# EAGLE design kompass2 (EAGLE 4.16)
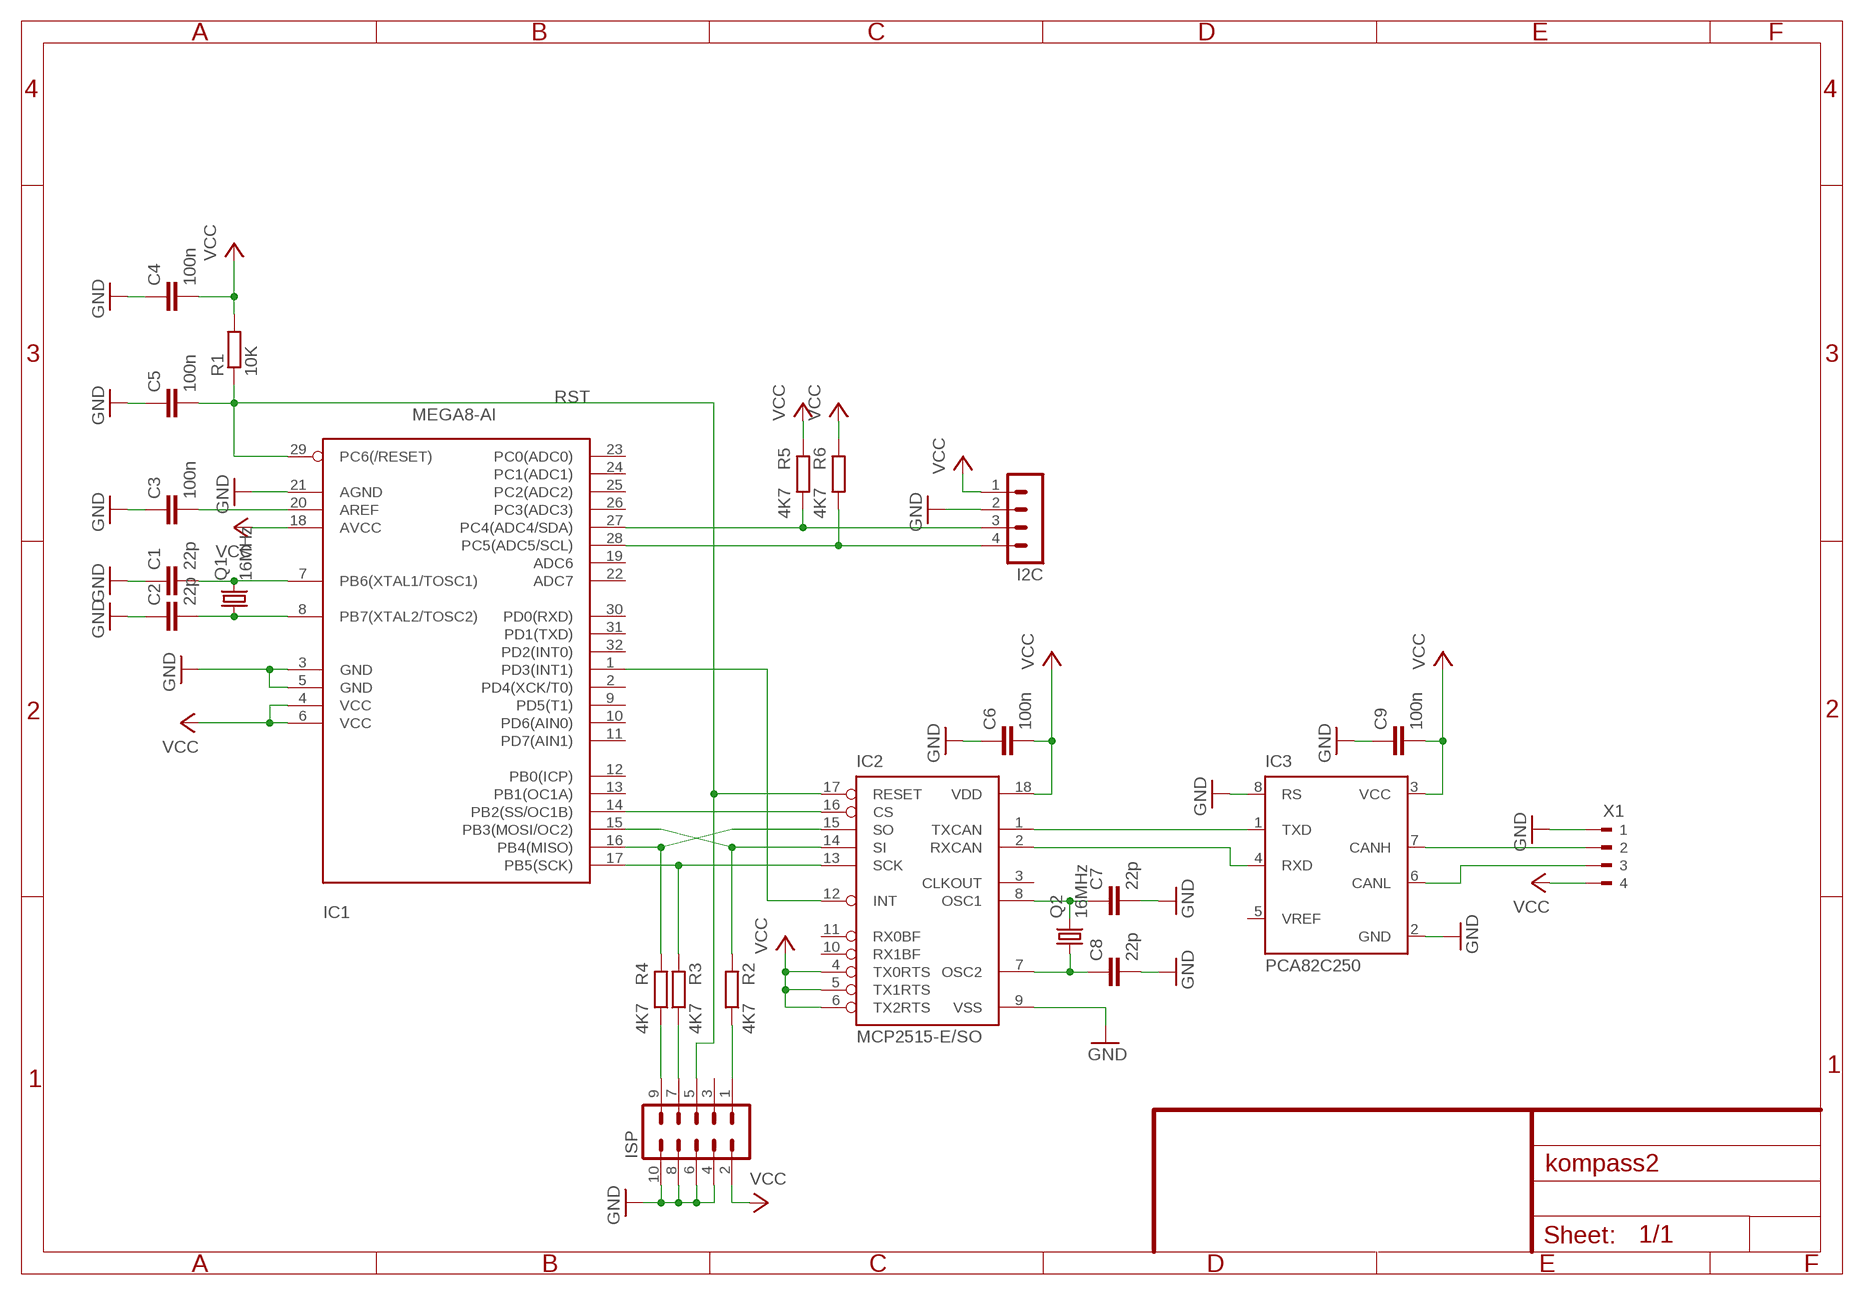
[diagram p0: schematic, sheet 1]

## Parts
C1  22p  C-EUC0603  [C0603]
C2  22p  C-EUC0603  [C0603]
C3  100n  C-EUC0603  [C0603]
C4  100n  C-EUC0603  [C0603]
C5  100n  C-EUC0603  [C0603]
C6  100n  C-EUC0603  [C0603]
C7  22p  C-EUC0603  [C0603]
C8  22p  C-EUC0603  [C0603]
C9  100n  C-EUC0603  [C0603]
I2C  MA04-1  [MA04-1]
IC1  MEGA8-AI  [TQFP32-08]
IC2  MCP2515-E/SO  [SO18L]
IC3  PCA82C250  [DIL08]
ISP  MA05-2  [MA05-2]
Q1  16MHz  CRYSTALHC49U-V  [HC49U-V]
Q2  16MHz  CRYSTALHC49U-V  [HC49U-V]
R1  10K  R-EU_R0805  [R0805]
R2  4K7  R-EU_R0805  [R0805]
R3  4K7  R-EU_R0805  [R0805]
R4  4K7  R-EU_R0805  [R0805]
R5  4K7  R-EU_R0805  [R0805]
R6  4K7  R-EU_R0805  [R0805]
X1  90-4  [90-4]

## Nets
GND: C1.1 C2.1 C3.1 C4.1 C5.1 C6.1 C7.2 C8.2 C9.1 I2C.2 IC1.3(GND) IC1.5(GND) IC1.21(AGND) IC2.9(VSS) IC3.2(GND) IC3.8(RS) ISP.4 ISP.6 ISP.8 ISP.10 X1.1
N$1: IC3.7(CANH) X1.2
N$2: IC3.6(CANL) X1.3
N$3: C1.2 IC1.7(PB6(XTAL1/TOSC1)) Q1.2
N$4: C2.2 IC1.8(PB7(XTAL2/TOSC2)) Q1.1
N$5: C3.2 IC1.20(AREF)
N$6: IC1.14(PB2(SS/OC1B)) IC2.16(CS)
N$7: IC1.17(PB5(SCK)) IC2.13(SCK) R3.2
N$8: IC1.16(PB4(MISO)) IC2.15(SO) R4.2
N$9: IC1.15(PB3(MOSI/OC2)) IC2.14(SI) R2.2
N$10: IC1.1(PD3(INT1)) IC2.12(INT)
N$11: IC2.1(TXCAN) IC3.1(TXD)
N$12: IC2.2(RXCAN) IC3.4(RXD)
N$13: C7.1 IC2.8(OSC1) Q2.2
N$14: C8.1 IC2.7(OSC2) Q2.1
N$15: ISP.1 R2.1
N$16: ISP.7 R3.1
N$17: ISP.9 R4.1
N$18: I2C.4 IC1.28(PC5(ADC5/SCL)) R6.1
N$19: I2C.3 IC1.27(PC4(ADC4/SDA)) R5.1
RST: C5.2 IC1.29(PC6(/RESET)) IC2.17(RESET) ISP.5 R1.1
VCC: C4.2 C6.2 C9.2 I2C.1 IC1.4(VCC) IC1.6(VCC) IC1.18(AVCC) IC2.4(TX0RTS) IC2.5(TX1RTS) IC2.6(TX2RTS) IC2.18(VDD) IC3.3(VCC) ISP.2 R1.2 R5.2 R6.2 X1.4
Unconnected: IC1.2(PD4(XCK/T0)) IC1.9(PD5(T1)) IC1.10(PD6(AIN0)) IC1.11(PD7(AIN1)) IC1.12(PB0(ICP)) IC1.13(PB1(OC1A)) IC1.19(ADC6) IC1.22(ADC7) IC1.23(PC0(ADC0)) IC1.24(PC1(ADC1)) IC1.25(PC2(ADC2)) IC1.26(PC3(ADC3)) IC1.30(PD0(RXD)) IC1.31(PD1(TXD)) IC1.32(PD2(INT0)) IC2.3(CLKOUT) IC2.10(RX1BF) IC2.11(RX0BF) IC3.5(VREF) ISP.3

## Library data of the parts
C1-C9 = rcl:C-EU: CAPACITOR, European symbol
I2C = con-lstb:MA04-1: PIN HEADER
IC1 = atmel:MEGA8: MICROCONTROLLER 8 Kbytes FLASH 1 kbytes SRAM 512 bytes EEPROM USART 6-channel 10 bit ADC 2-channel 8 bit ADC Source: avr.lbr
IC2 = mcp2515:MCP2515
IC3 = micro-philips:PCA82C250: CAN CONTROLLER INTERFACE
ISP = con-lstb:MA05-2: PIN HEADER
Q1 Q2 = crystal:CRYSTAL: CRYSTAL
R1-R6 = rcl:R-EU_: RESISTOR, European symbol
X1 = con-weidmueller-sl35:90-4: WEIDMUELLER CLAMP CONNECTOR

## Board
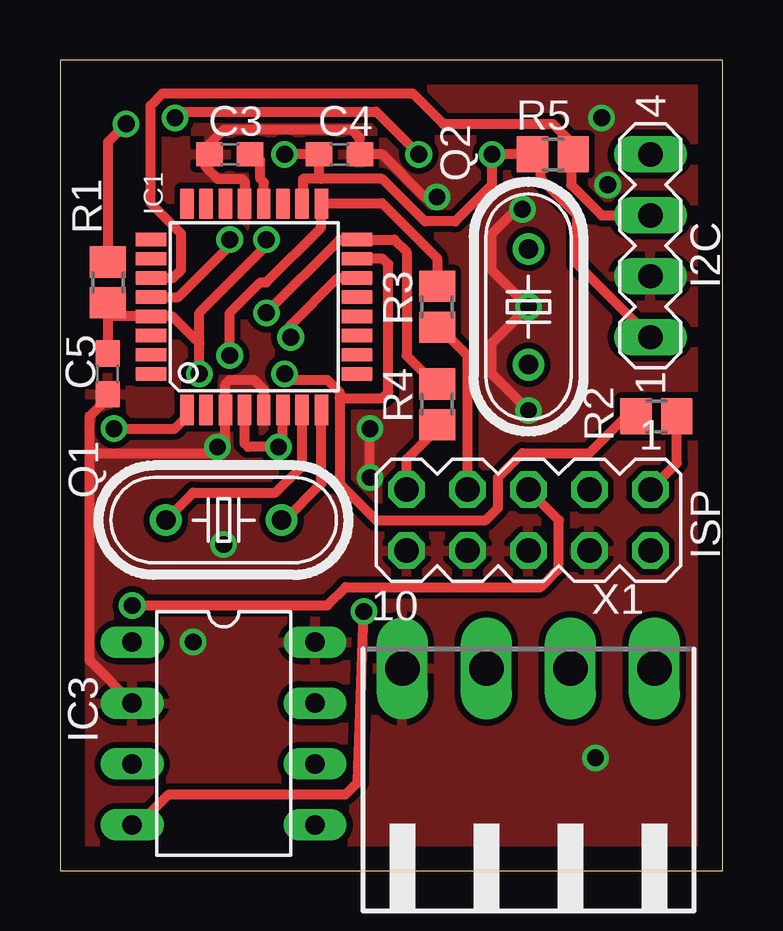
[diagram p1: board, top side]
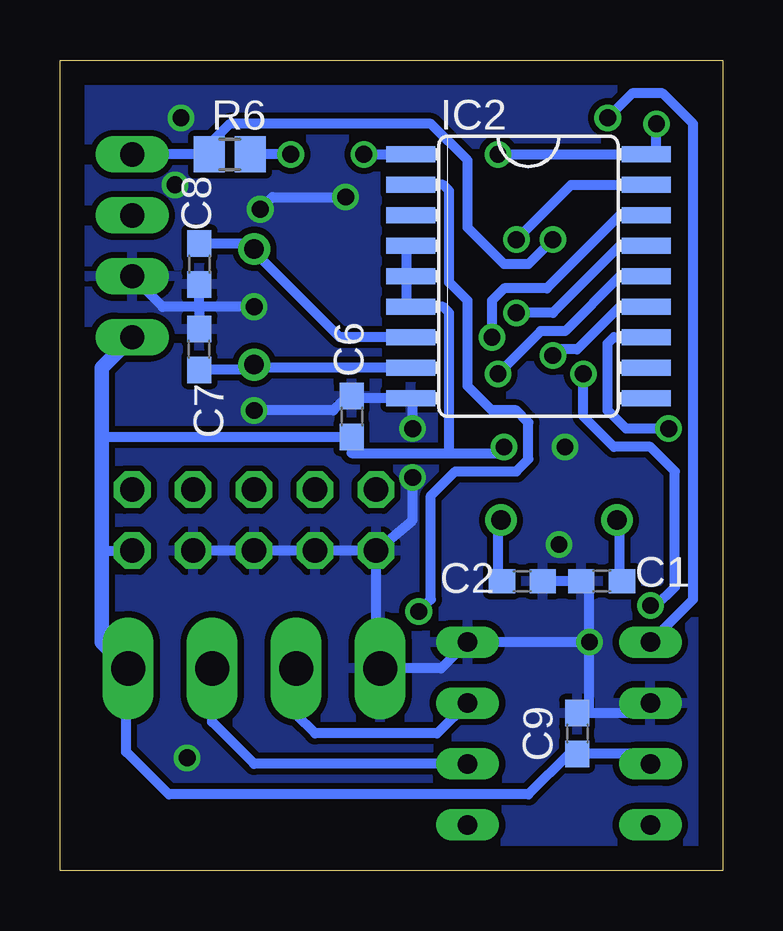
[diagram p2: board, bottom side, seen from below]

Size 27.61 x 33.77 mm. Coordinates in mm from the lower left corner, seen from the top.
Outline: 0,0 27.61,0 27.61,33.77 0,33.77 0,0
Copper layers (1*16): Top 0.035mm / dielectric 1.5mm / Bottom 0.035mm
Design rules "olimex_8mils": minimum track width 10mil, minimum drill 24mil, track to track 8mil, track to pad 8mil, pad to pad 8mil, via to via 8mil, smd to smd 8mil, copper to edge 40mil, drill to drill 10mil, minimum pad ring 10mil, minimum via ring 8mil, stop-mask expansion 0mil, vias tented up to drill 0mil, thermal gap 10mil

### Footprints (pad centres in the part's own frame; a part is rotated, then mirrored left to right if it is on the bottom)
C0603 = smd 1.1 x 1: 1 -0.85,0; 2 0.85,0
MA04-1 = drill 1.016 long: 1 -3.81,0; 2 -1.27,0; 3 1.27,0; 4 3.81,0
TQFP32-08 = smd 1.27 x 0.559: 1 -4.293,2.8; 2 -4.293,2; 3 -4.293,1.2; 4 -4.293,0.4; 5 -4.293,-0.4; 6 -4.293,-1.2; 7 -4.293,-2; 8 -4.293,-2.8; 17 4.293,-2.8; 18 4.293,-2; 19 4.293,-1.2; 20 4.293,-0.4; 21 4.293,0.4; 22 4.293,1.2; 23 4.293,2; 24 4.293,2.8 | smd 0.559 x 1.27: 9 -2.8,-4.293; 10 -2,-4.293; 11 -1.2,-4.293; 12 -0.4,-4.293; 13 0.4,-4.293; 14 1.2,-4.293; 15 2,-4.293; 16 2.8,-4.293; 25 2.8,4.293; 26 2,4.293; 27 1.2,4.293; 28 0.4,4.293; 29 -0.4,4.293; 30 -1.2,4.293; 31 -2,4.293; 32 -2.8,4.293
SO18L = smd 0.66 x 2.032: 1 -5.08,-4.902; 2 -3.81,-4.902; 3 -2.54,-4.902; 4 -1.27,-4.902; 5 0,-4.902; 6 1.27,-4.902; 7 2.54,-4.902; 8 3.81,-4.902; 9 5.08,-4.902; 10 5.08,4.902; 11 3.81,4.902; 12 2.54,4.902; 13 1.27,4.902; 14 0,4.902; 15 -1.27,4.902; 16 -2.54,4.902; 17 -3.81,4.902; 18 -5.08,4.902
DIL08 = drill 0.813 long: 1 -3.81,-3.81; 2 -1.27,-3.81; 3 1.27,-3.81; 4 3.81,-3.81; 5 3.81,3.81; 6 1.27,3.81; 7 -1.27,3.81; 8 -3.81,3.81
MA05-2 = drill 1.016 octagon: 1 -5.08,-1.27; 2 -5.08,1.27; 3 -2.54,-1.27; 4 -2.54,1.27; 5 0,-1.27; 6 0,1.27; 7 2.54,-1.27; 8 2.54,1.27; 9 5.08,-1.27; 10 5.08,1.27
HC49U-V = drill 0.813 round: 1 -2.413,0; 2 2.413,0
R0805 = smd 1.3 x 1.5: 1 -0.85,0; 2 0.85,0
90-4 = drill 1.422 long: 1 -5.25,5.25; 2 -1.75,5.25; 3 1.75,5.25; 4 5.25,5.25

### Placement (x,y rotation side)
C1  5.04,12.06 0 bottom
C2  8.34,12.06 180 bottom
C3  7.07,29.84 0 top
C4  11.65,29.84 180 top
C5  1.99,20.7 90 top
C6  15.46,18.92 270 bottom
C7  21.81,21.71 90 bottom
C8  21.81,25.27 270 bottom
C9  6.06,5.71 270 bottom
I2C  24.6,26.03 90 top
IC1  8.09,23.49 90 top
IC2  8.09,24.76 270 bottom
IC3  6.82,5.71 270 top
ISP  19.52,14.6 180 top
Q1  6.82,14.6 180 top
Q2  19.52,23.49 270 top
R1  1.99,24.51 90 top
R2  24.85,18.92 180 top
R3  15.71,23.49 90 top
R4  15.71,19.43 90 top
R5  20.54,29.84 180 top
R6  20.54,29.84 0 bottom
X1  19.52,3.17 0 top

### Tracks (layer width: path | path; a pad name or v marks a point on that pad's centre or on a via)
GND  (via drill 0.7)
  Top 0.406: IC1.5 8.49,20.04 8.09,20.44 7.07,20.44 6.89,20.26 IC1.3 6.89,17.97 v6.57,17.65 6.31,17.39 1.23,17.39 | IC3.2 1.23,8.76 1.23,17.39 | v19.52,19.17 18,20.7 18,21.97 v19.52,23.49 18,25.01 18,26.54 19.01,27.55 v19.27,27.55 | IC1.21 7.69,28.72 7.58,28.82 6.57,28.82 6.06,29.33 6.06,29.84 C3.1 6.22,29.93 6.06,30.09 6.82,30.86 12.15,30.86 12.5,30.51 C4.1 13.42,29.84 15.2,28.06 v15.71,28.06 | C5.1 1.99,19.68 1.23,18.92 1.23,17.39 | v12.92,16.38 v12.92,18.41
  Bottom 0.406: v5.55,9.52 IC3.8 11.73,8.42 X1.1 14.44,8.25 ISP.10 | ISP.10 ISP.8 ISP.6 ISP.4 | 21.81,23.49 C7.2 | 21.81,23.49 C8.2 | C2.1 C1.1 5.55,12.06 v5.55,9.52 | IC3.2 3.26,6.98 3.68,6.56 5.55,6.56 | 5.55,6.56 C9.1 | 15.46,19.93 C6.1 | 15.46,19.93 15.2,19.68 IC2.9 12.92,19.68 v12.92,18.41 | v19.52,23.49 21.81,23.49 | 15.46,19.93 16.22,19.17 v19.52,19.17 | v15.71,28.06 18.76,28.06 v19.27,27.55 | 5.55,6.56 v5.55,9.52 | ISP.10 12.92,14.6 v12.92,16.38 | 21.81,23.49 23.33,23.49 I2C.2
  other vias: 6.82,13.58 22.31,4.69 22.82,28.57 22.57,31.36
  pour Bottom (isolate 0.254): -0.04,33.65 27.65,33.65 27.65,0.12 -0.04,0.12
  pour Top (isolate 0.254): -0.04,0.12 27.65,0.12 27.65,33.65 -0.04,33.65
N$1
  Bottom 0.406: X1.2 17.77,6.5 16.98,5.71 11.9,5.71 IC3.7
N$2
  Bottom 0.406: X1.3 21.27,6.19 19.52,4.44 IC3.6
N$3
  Top 0.406: IC1.7 10.09,16.85 8.98,15.74 5.55,15.74 Q1.2
  Bottom 0.406: C1.2 4.28,12.15 4.28,14.47 Q1.2
N$4
  Top 0.406: Q1.1 9.36,14.6 10.89,16.13 IC1.8
  Bottom 0.406: C2.2 9.36,12.06 9.36,14.47 Q1.1
N$5
  Top 0.406: IC1.20 8.49,28.68 8.34,28.82 8.34,29.59 8.09,29.84 C3.2
N$6  (via drill 0.7)
  Top 0.406: IC1.14 11.58,24.69 9.61,22.73 v9.61,22.22
  Bottom 0.406: IC2.16 4.28,27.3 7.33,24.25 9.11,24.25 9.61,23.74 v9.61,22.22
N$7  (via drill 0.7)
  Top 0.406: R3.2 15.71,25.52 13.42,27.81 10.88,27.81 10.89,27.8 IC1.17 | 10.88,27.55 IC1.17 | 10.88,27.55 10.89,27.56 IC1.17 | v7.07,21.46 7.07,23.24 8.34,24.51 8.6,24.51 10.88,26.79 10.88,27.55
  Bottom 0.406: IC2.13 4.28,23.49 6.06,21.71 6.82,21.71 v7.07,21.46
N$8  (via drill 0.7)
  Top 0.406: 12.16,26.29 12.15,26.28 13.93,26.28 14.44,25.78 14.44,21.46 15.62,20.28 R4.2 | 12.16,26.29 IC1.16 | 12.16,26.29 11.65,26.29 v8.6,23.24
  Bottom 0.406: v8.6,23.24 8.34,23.24 7.07,23.24 4.28,26.03 IC2.15
N$9  (via drill 0.7)
  Top 0.406: R2.2 23.58,18.92 22.06,17.39 19.27,17.39 18.25,16.38 18.25,15.11 17.74,14.6 13.17,14.6 11.65,16.12 11.65,19.68 | IC1.15 13.46,25.49 13.68,25.27 13.68,19.93 13.42,19.68 11.65,19.68 | v9.36,20.7 9.61,20.44 11.14,20.44 11.65,19.93 11.65,19.68
  Bottom 0.406: IC2.14 4.28,24.76 6.57,22.47 7.58,22.47 v9.36,20.7
N$10  (via drill 0.7)
  Top 0.406: IC1.1 5.29,18.92 5.3,18.92 4.79,18.41 v2.25,18.41
  Bottom 0.406: IC2.12 4.53,22.22 4.79,21.97 4.79,19.17 4.03,18.41 v2.25,18.41
N$11  (via drill 0.7)
  Top 0.406: v4.79,31.36 5.04,31.62 13.17,31.62 v14.95,29.84
  Bottom 0.406: 13.17,29.84 IC2.1 v14.95,29.84 | IC3.1 1.23,11.3 1.23,31.11 2.5,32.38 3.77,32.38 v4.79,31.36
N$12  (via drill 0.7)
  Top 0.406: v12.66,10.79 12.41,3.68 11.9,3.17 4.53,3.17 3.26,1.9 IC3.4
  Bottom 0.406: IC2.2 11.65,28.57 11.39,28.32 11.39,24.51 10.63,23.74 10.63,20.19 9.61,19.17 8.6,19.17 8.09,18.66 8.09,17.14 8.6,16.63 11.14,16.63 12.15,15.62 12.15,11.3 v12.66,10.79
N$13
  Bottom 0.406: IC2.8 19.52,20.95 | 19.52,20.95 Q2.2 | C7.1 19.61,20.86 19.52,20.95
N$14
  Bottom 0.406: IC2.7 15.96,22.22 19.52,25.78 | 19.52,25.78 Q2.1 | C8.1 19.86,26.12 19.52,25.78
N$15
  Top 0.406: R2.1 25.7,16.97 ISP.1
N$16
  Top 0.406: R3.1 15.8,22.64 16.98,21.46 ISP.7
N$17
  Top 0.406: R4.1 15.71,18.41 14.44,17.14 ISP.9
N$18  (via drill 0.7)
  Top 0.406: IC1.28 4.93,23.89 7.07,26.03 v7.07,26.28
  Bottom 0.406: 21.3,29.84 R6.1 I2C.4 | 21.3,29.84 21.3,29.33 | 21.3,29.84 21.3,30.35 20.54,31.11 12.15,31.11 10.63,29.59 10.63,26.79 9.11,25.27 8.09,25.27 v7.07,26.28
N$19
  Top 0.406: 21.39,30.01 R5.1 21.3,29.84 | 21.3,29.84 21.3,30.35 20.54,31.11 15.96,31.11 14.69,32.38 4.28,32.38 3.77,31.87 3.77,27.81 5.04,26.54 5.04,25.01 4.72,24.69 IC1.27 | I2C.3 22.57,27.3 21.3,28.57 21.3,29.84
RST  (via drill 0.7)
  Top 0.406: 1.99,23.24 C5.2 | 1.99,23.24 R1.1 | 1.99,23.24 2.14,23.09 IC1.29 4.68,23.09 5.8,21.97 | ISP.5 20.79,14.6 20.79,12.57 20.03,11.81 11.9,11.81 11.14,11.04 v3.01,11.04 | v8.6,26.28 8.6,26.03 5.8,23.24 5.8,21.97 | v5.8,20.7 5.8,21.97
  Bottom 0.406: v3.01,11.04 2.76,11.04 1.99,11.81 1.99,16.63 3.01,17.65 4.53,17.65 5.8,18.92 v5.8,20.7 | v8.6,26.28 6.31,28.57 IC2.17
VCC  (via drill 0.7)
  Top 0.406: IC1.4 7.69,17.79 7.84,17.65 v9.11,17.65 9.29,17.83 IC1.6 | IC1.18 10.12,27.81 10.12,28.82 10.88,28.82 | R6.2 v18,29.84 18,28.57 16.47,27.05 15.2,27.05 13.42,28.82 10.88,28.82 | C4.2 10.8,29.75 | R6.2 19.69,29.67 | R6.2 19.77,29.84 20.03,29.59 20.03,28.82 21.55,27.3 21.55,25.27 I2C.1 | 10.63,30.09 10.8,29.93 C4.2 | C4.2 v9.36,29.84 | R1.2 1.99,30.35 v2.76,31.11 | C4.2 10.8,28.91 10.88,28.82
  Bottom 0.406: IC2.4 13.17,25.85 13.17,24.76 IC2.5 13.17,24.58 13.17,23.49 IC2.6 11.65,23.49 11.39,23.24 11.39,17.39 | IC3.3 3.43,4.86 C9.2 6.4,4.86 8.09,3.17 23.08,3.17 24.85,4.95 24.85,8.25 24.77,8.33 X1.4 | 25.87,13.33 ISP.2 | v18,29.84 R6.2 | C6.2 25.78,18.07 25.87,18.16 | C6.2 15.46,18.16 15.37,18.07 | v9.36,29.84 IC2.18 2.76,29.84 v2.76,31.11 | C6.2 15.46,17.39 11.39,17.39 | 11.39,17.39 9.36,17.39 v9.11,17.65
  Bottom 0.61: I2C.1 25.87,20.95 25.87,18.16 25.87,13.33 25.87,9.52 X1.4 24.6,8.25